# Altium schematic sheet Sensor.SchDoc
size A4; Organization: WMG; Address1: University of Warwick; Address2: WM355; SheetNumber: 2; SheetTotal: 3
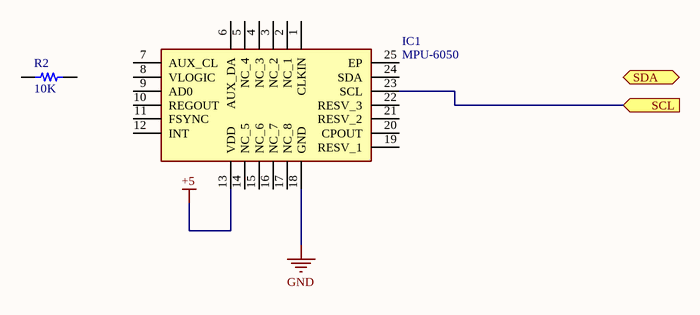
[diagram p0: Sensor.SchDoc]

## Parts
IC1  MPU-6050  [MPU6050]
R2  10K  [RES 0603_1608]

## Ports
SCL (in), SDA (bidir)

## Nets
+5: IC1.13(VDD)
GND: IC1.18(GND)
SCL: IC1.23(SCL) ; port SCL

Not connected (* = marked no-connect by the designer): IC1 1(CLKIN) 2(NC_1) 3(NC_2) 4(NC_3) 5(NC_4) 6(AUX_DA) 7(AUX_CL) 8(VLOGIC) 9(AD0) 10(REGOUT) 11(FSYNC) 12(INT) 14(NC_5) 15(NC_6) 16(NC_7) 17(NC_8) 19(RESV_1) 20(CPOUT) 21(RESV_2) 22(RESV_3) 24(SDA) 25(EP); R2 1 2

## Notes on the sheet
- Title
- Size:
- Date:
- A4
- Number:
- Time:
- Revision:
- Sheet
- of
- File:

## Library data of the parts
IC1 = MPU-6050: Integrated Circuit; Manufacturer_Name: TDK; Datasheet Link: https://invensense.tdk.com/wp-content/uploads/2015/02/MPU-6000-Datasheet1.pdf; Height: 0.95mm; Manufacturer_Part_Number: MPU-6050; Mouser Part Number: 410-MPU-6050; Mouser Price/Stock: https://www.mouser.co.uk/ProductDetail/TDK-InvenSense/MPU-6050?qs=u4fy%2FsgLU9O14B5JgyQFvg%3D%3D; Arrow Part Number: MPU-6050; Arrow Price/Stock: https://www.arrow.com/en/products/mpu-6050/invensense?region=nac
R2 = Resistor: SMT Resistor